# Altium schematic sheet RTC.SchDoc
size A3; PageSetup: Record=PageOptions|CenterHorizontal=True|CenterVertical=True|PrintScale=0.73|XCorrection=1.00|YCorrection=1.00|PrintKind=0|BorderSize=5000000|LeftOffset=0|BottomOffset=0|Orientation=2|PaperLength=1000|PaperWidth=1000|Scale=100|PaperSource=7|PrintQuality=-4|MediaType=1|DitherType=10|PaperKind=A4|PrintScaleMode=1; Date: 27.05.2014; DrawnBy: luths8; Organization: BFH; Address1: Bern University of Applied Sciences; Address2: Engineering and Information Technology; Address3: Jlcoweg 1; Address4: CH-3400 Burgdorf; DocumentNumber: 5; Revision: 1.0; SheetNumber: 8; SheetTotal: 19; CurrentDate: 27.05.2014
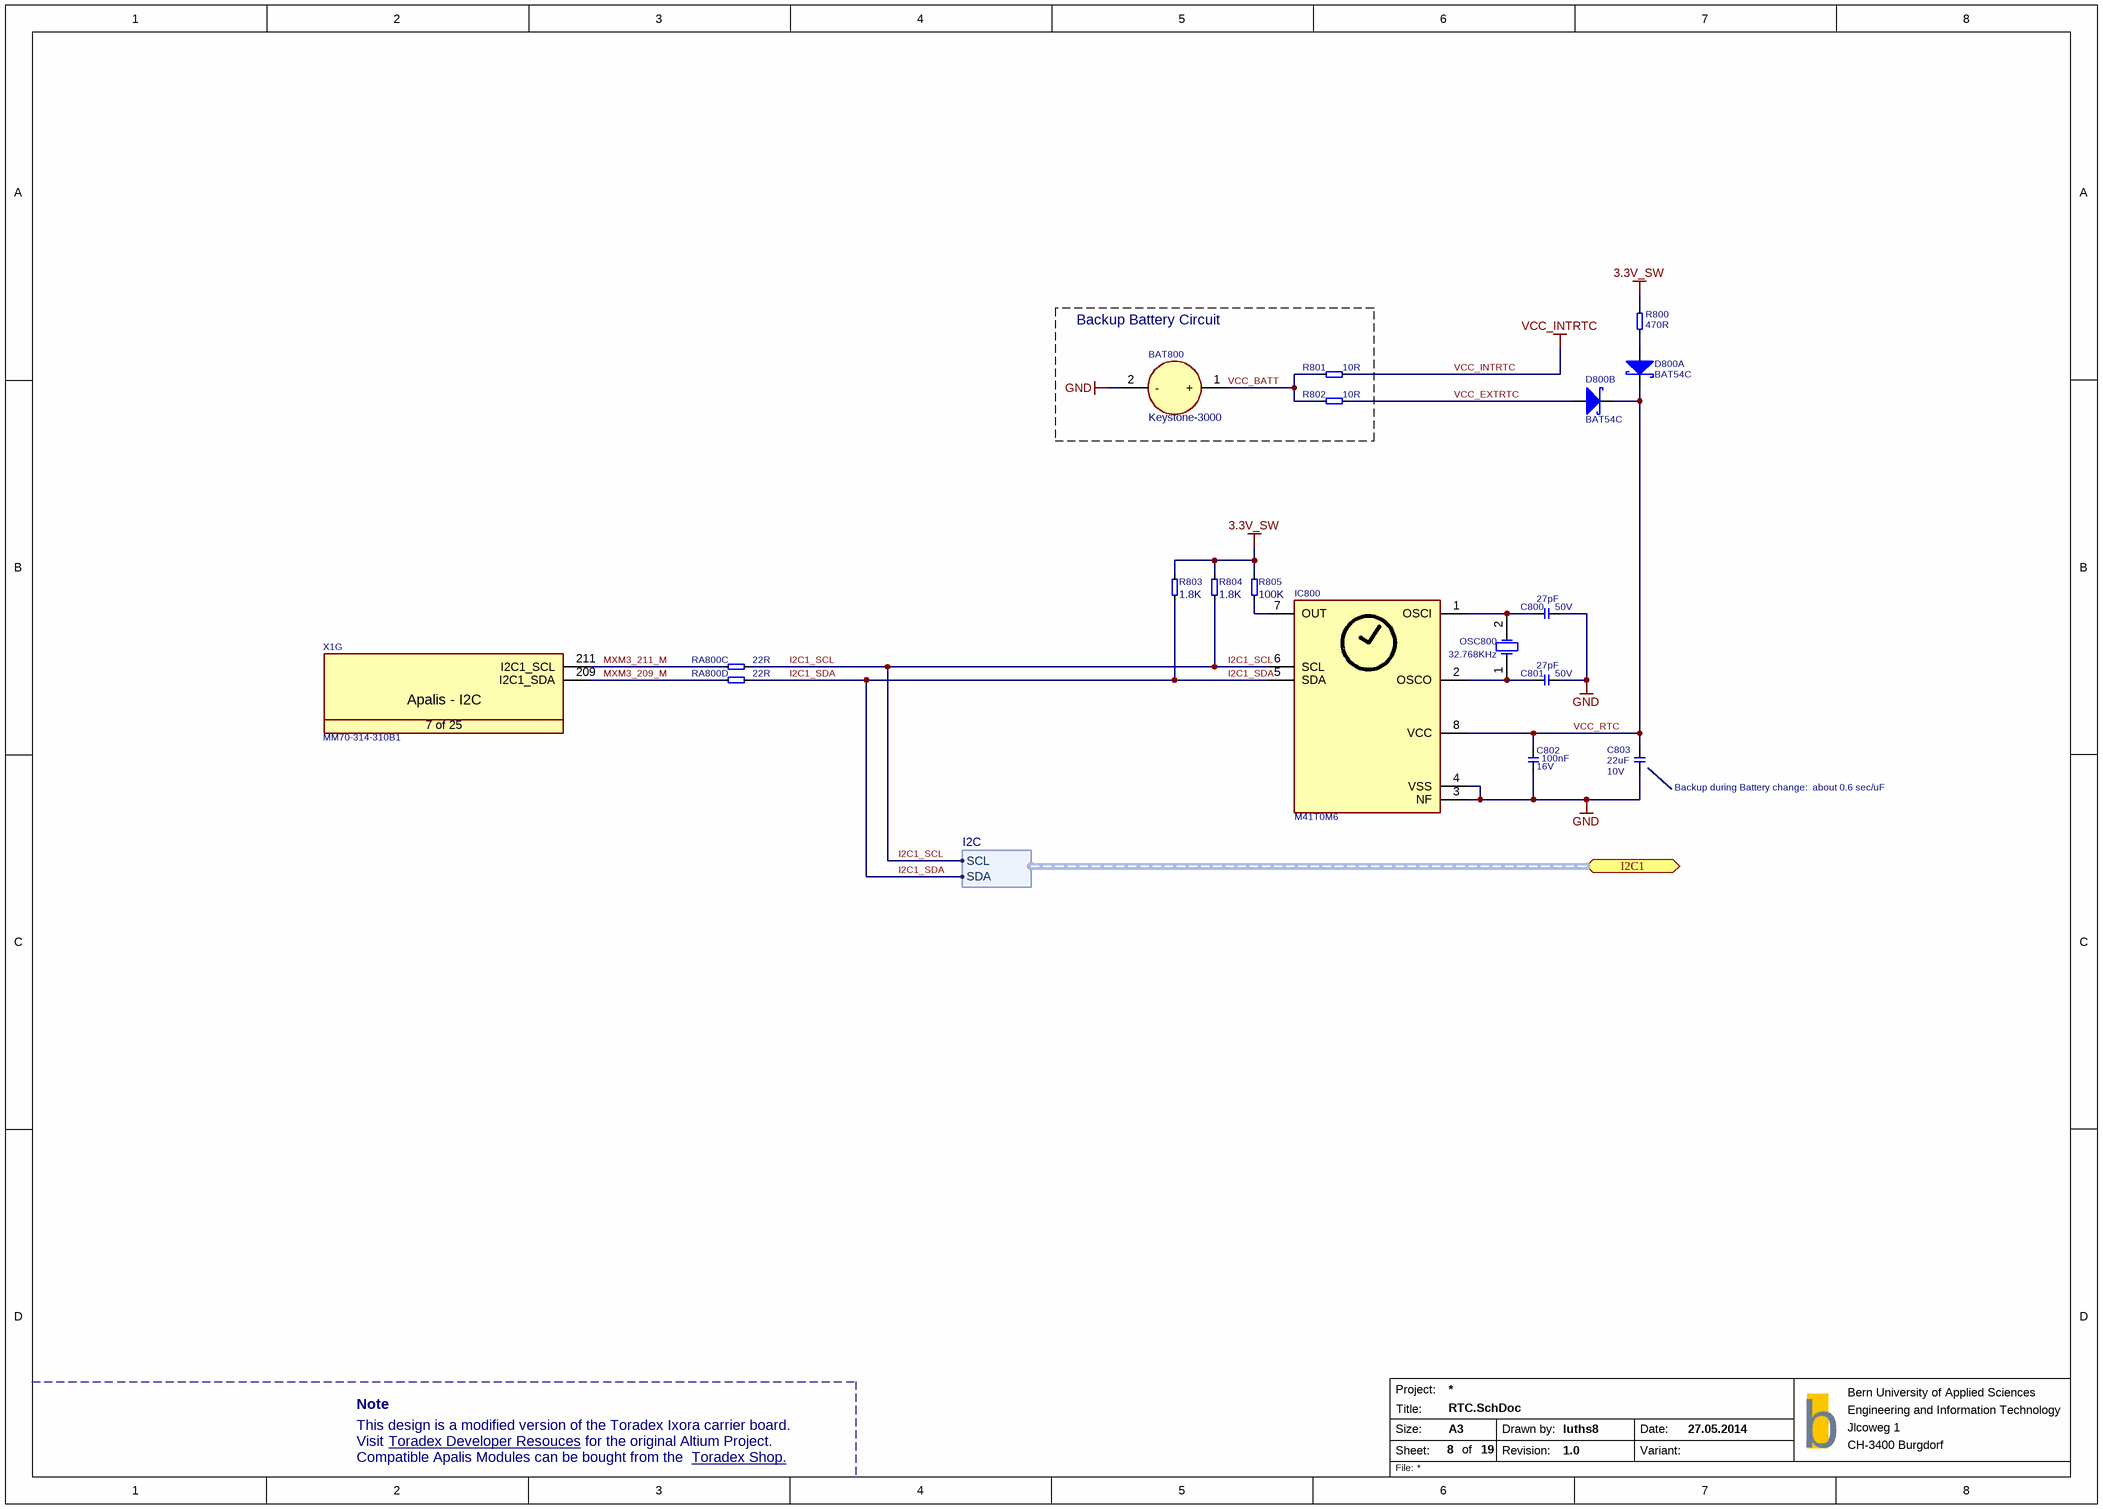
[diagram p0: RTC.SchDoc]

## Parts
BAT800  Keystone-3000  [T_Keystone_3000]
C800  Rating: 50V  [SMD0603CAP]  (hidden comment: 27pF)
C801  Rating: 50V  [SMD0603CAP]  (hidden comment: 27pF)
C802  Rating: 16V  [SMD0603CAP]  (hidden comment: 100nF)
C803  Rating: 10V  [SMD0805CAP]  (hidden comment: 22uF)
D800  BAT54C  [SOT95P230X110-3N]  (parts A,B of 2)
IC800  M41T0M6  [SOIC127P600X173-8N]
OSC800  value 32.768KHz  [T_MC_CC4V-T1A]  (hidden comment: CC4V-T1A)
R800  470R  [SMD0603RES]
R801  10R  [SMD0603RES]
R802  10R  [SMD0603RES]
R803  1.8K  [SMD0603RES]
R804  1.8K  [SMD0603RES]
R805  100K  [SMD0603RES]
RA800  22R  [T_Resistor_Array_X4]  (parts C,D of 4)
X1  Manufacturer Part No.: MM70-314-310B1  [T_JAE_MM70-314-310B1]  (hidden comment: CON-JAE-MM70-314-310B1-314-0.5mm)  (part G of 25)

## Blocks framed on the sheet
Backup Battery Circuit: BAT800 R801 R802

## Ports
I2C1 (bidir, harness I2C, see 12, 17, 18, 19)

## Harnesses
I2C: SCL, SDA

## Nets
3.3V_SW: R800.2 R803.2 R804.2 R805.2
GND: BAT800.2(-) C800.2 C801.2 C802.1 C803.2 IC800.3(NF) IC800.4(VSS)
VCC_INTRTC: R801.2
I2C1_SCL: IC800.6(SCL) R804.1 RA800.7 ; port I2C1.SCL
I2C1_SDA: IC800.5(SDA) R803.1 RA800.8 ; port I2C1.SDA
MXM3_209_M: RA800.4 X1.209(I2C1_SDA)
MXM3_211_M: RA800.3 X1.211(I2C1_SCL)
VCC_BATT: BAT800.1(+) R801.1 R802.1
VCC_EXTRTC: D800.2 R802.2
VCC_RTC: C802.2 C803.1 D800.3 IC800.8(VCC)
NetC800_1: C800.1 IC800.1(OSCI) OSC800.2(OSC2)
NetC801_1: C801.1 IC800.2(OSCO) OSC800.1(OSC1)
NetD800_1: D800.1 R800.1
NetIC800_7: IC800.7(OUT) R805.1

## Notes on the sheet
- (near C803) Backup during Battery change:  about 0.6 sec/uF
- Note
- This design is a modified version of the Toradex Ixora carrier board.
- Visit
- Compatible Apalis Modules can be bought from the
- Toradex Developer Resouces <https://developer.toradex.com/products/ixora-carrier-board>
- for the original Altium Project.
- Toradex Shop. <https://www.toradex.com/order-now/apalis-arm-family>
- Project:
- Size:
- Sheet:
- Title:
- A3
- of
- Drawn by:
- Revision:
- Date:
- Variant:
- b
- File:
- (in symbol CON-JAE-MM70-314-310B1-314-0.5mm, part G) Apalis - I2C; 7 of 25

## Library data of the parts
BAT800 = BAT-Keystone-3000: Battery Holder; Manufacturer Part No.: 3000; Manufacturer Name: Keystone
C800 C801 = C-NPO-27pF-50V-5%-0603: Capacitor Ceramic NPO 27pF 50V 5% 0603; Tolerance: 5%; Type: NPO; Value: 27pF
C802 = C-X7R-100nF-16V-10%-0402: Capacitor Ceramic X7R 100nF 16V 10% 0603; Tolerance: 10%; Type: X7R; Value: 100nF
C803 = C-X5R-22uF-10V-20%-0805: Capacitor Ceramic X5R 22uF 10V 20% 0805; Tolerance: 20%; Type: X5R; Value: 22uF
D800 = D-Philips-BAT54C-Schottky-30V-200mA: BAT54 Schottky Diode; Manufacturer: Philips; Manufacturer Part No.: BAT54C
IC800 = IC-ST-M41T0M6: RTC M41T0M6; Manufacturer Name: ST; Manufacturer Part No.: M41T0M6
OSC800 = OSC-MC-CC4V-T1A-32.768KHz-30ppm-5x1.9mm: Quartz 32.768kHz; Manufacturer Name: Micro Crystal; Tolerance: 30ppm; Manufacturer Part No.: CC4V-T1A
R800 = R-470R-63mW-5%-0402: Resistor 470 ohm 63mW 5% 0603; Rating: 63mW; Tolerance: 5%; Value: 470R
R801 R802 = R-10R-63mW-5%-0603: Resistor 10 ohm 63mW 5% 0603; Rating: 63mW; Tolerance: 5%; Value: 10R
R803 R804 = R-1.8KR-63mW-5%-0402: Resistor 1.8 Kohm 63mW 5% 0603; Value: 1.8KR; Rating: 63mW; Tolerance: 5%
R805 = R-100KR-63mW-5%-0402: Resistor 100 Kohm 63mW 5% 0603; Value: 100KR; Rating: 63mW; Tolerance: 5%
RA800 = RA-22R-63mW-5%-1206-div: Resistor Array 22 R 63mW 5% 1206; Tolerance: 5%; Power Dissipation: 63mW; Value: 22R
X1 = CON-JAE-MM70-314-310B1-314-0.5mm: MXM3 Connector; Manufacturer Name: JAE; No. of ways: 314